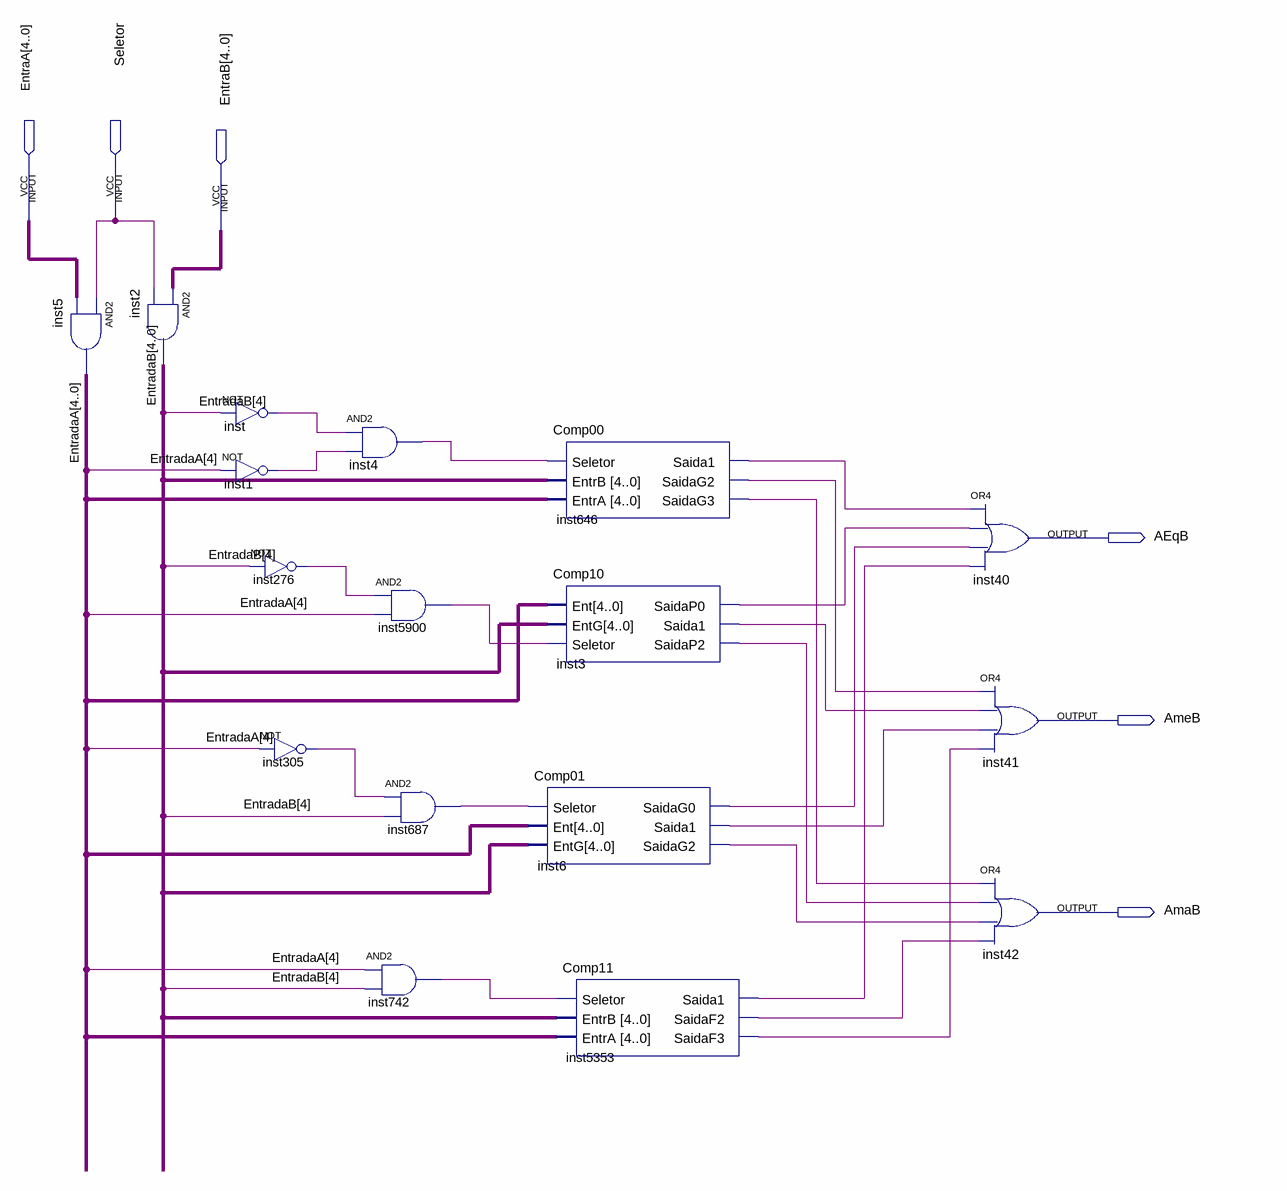
[diagram p0: schematic sheet]
// Quartus schematic ComparadorGeral.bdf as structural Verilog: 17 symbols, 6 pins
module ComparadorGeral (
  input  [4:0] EntraA,
  input  Seletor,
  input  [4:0] EntraB,
  output AEqB,
  output AmeB,
  output AmaB
);

  wire inst1_out, inst3_saida1, inst3_saidap0, inst3_saidap2, inst4_out, inst6_saida1, inst6_saidag0,
       inst6_saidag2, inst276_out, inst305_out, inst646_saida1, inst646_saidag2, inst646_saidag3,
       inst687_out, inst742_out, inst5353_saida1, inst5353_saidaf2, inst5353_saidaf3, inst5900_out, inst_out;
  wire [4:0] EntradaA, EntradaB;

  assign EntradaA = {5{Seletor}} & EntraA;  // AND2 inst5, 5 bits wide
  assign EntradaB = EntraB & {5{Seletor}};  // AND2 inst2, 5 bits wide
  not inst (inst_out, EntradaB[4]);
  not inst1 (inst1_out, EntradaA[4]);
  not inst276 (inst276_out, EntradaB[4]);
  not inst305 (inst305_out, EntradaA[4]);
  and inst4 (inst4_out, inst_out, inst1_out);
  and inst5900 (inst5900_out, inst276_out, EntradaA[4]);
  and inst687 (inst687_out, inst305_out, EntradaB[4]);
  and inst742 (inst742_out, EntradaA[4], EntradaB[4]);
  Comp01 inst6 (
    .Seletor(inst687_out), .Ent(EntradaA), .EntG(EntradaB), .SaidaG0(inst6_saidag0), .Saida1(inst6_saida1),
    .SaidaG2(inst6_saidag2));
  Comp00 inst646 (
    .Seletor(inst4_out), .EntrB(EntradaB), .EntrA(EntradaA), .Saida1(inst646_saida1),
    .SaidaG2(inst646_saidag2), .SaidaG3(inst646_saidag3));
  Comp10 inst3 (
    .Ent(EntradaA), .EntG(EntradaB), .Seletor(inst5900_out), .SaidaP0(inst3_saidap0), .Saida1(inst3_saida1),
    .SaidaP2(inst3_saidap2));
  Comp11 inst5353 (
    .Seletor(inst742_out), .EntrB(EntradaB), .EntrA(EntradaA), .Saida1(inst5353_saida1),
    .SaidaF2(inst5353_saidaf2), .SaidaF3(inst5353_saidaf3));
  or inst40 (AEqB, inst646_saida1, inst3_saidap0, inst6_saidag0, inst5353_saida1);
  or inst41 (AmeB, inst646_saidag2, inst3_saida1, inst6_saida1, inst5353_saidaf3);
  or inst42 (AmaB, inst646_saidag3, inst3_saidap2, inst6_saidag2, inst5353_saidaf2);
endmodule
